# EAGLE design KilomuxV2 (EAGLE 6.6.0)
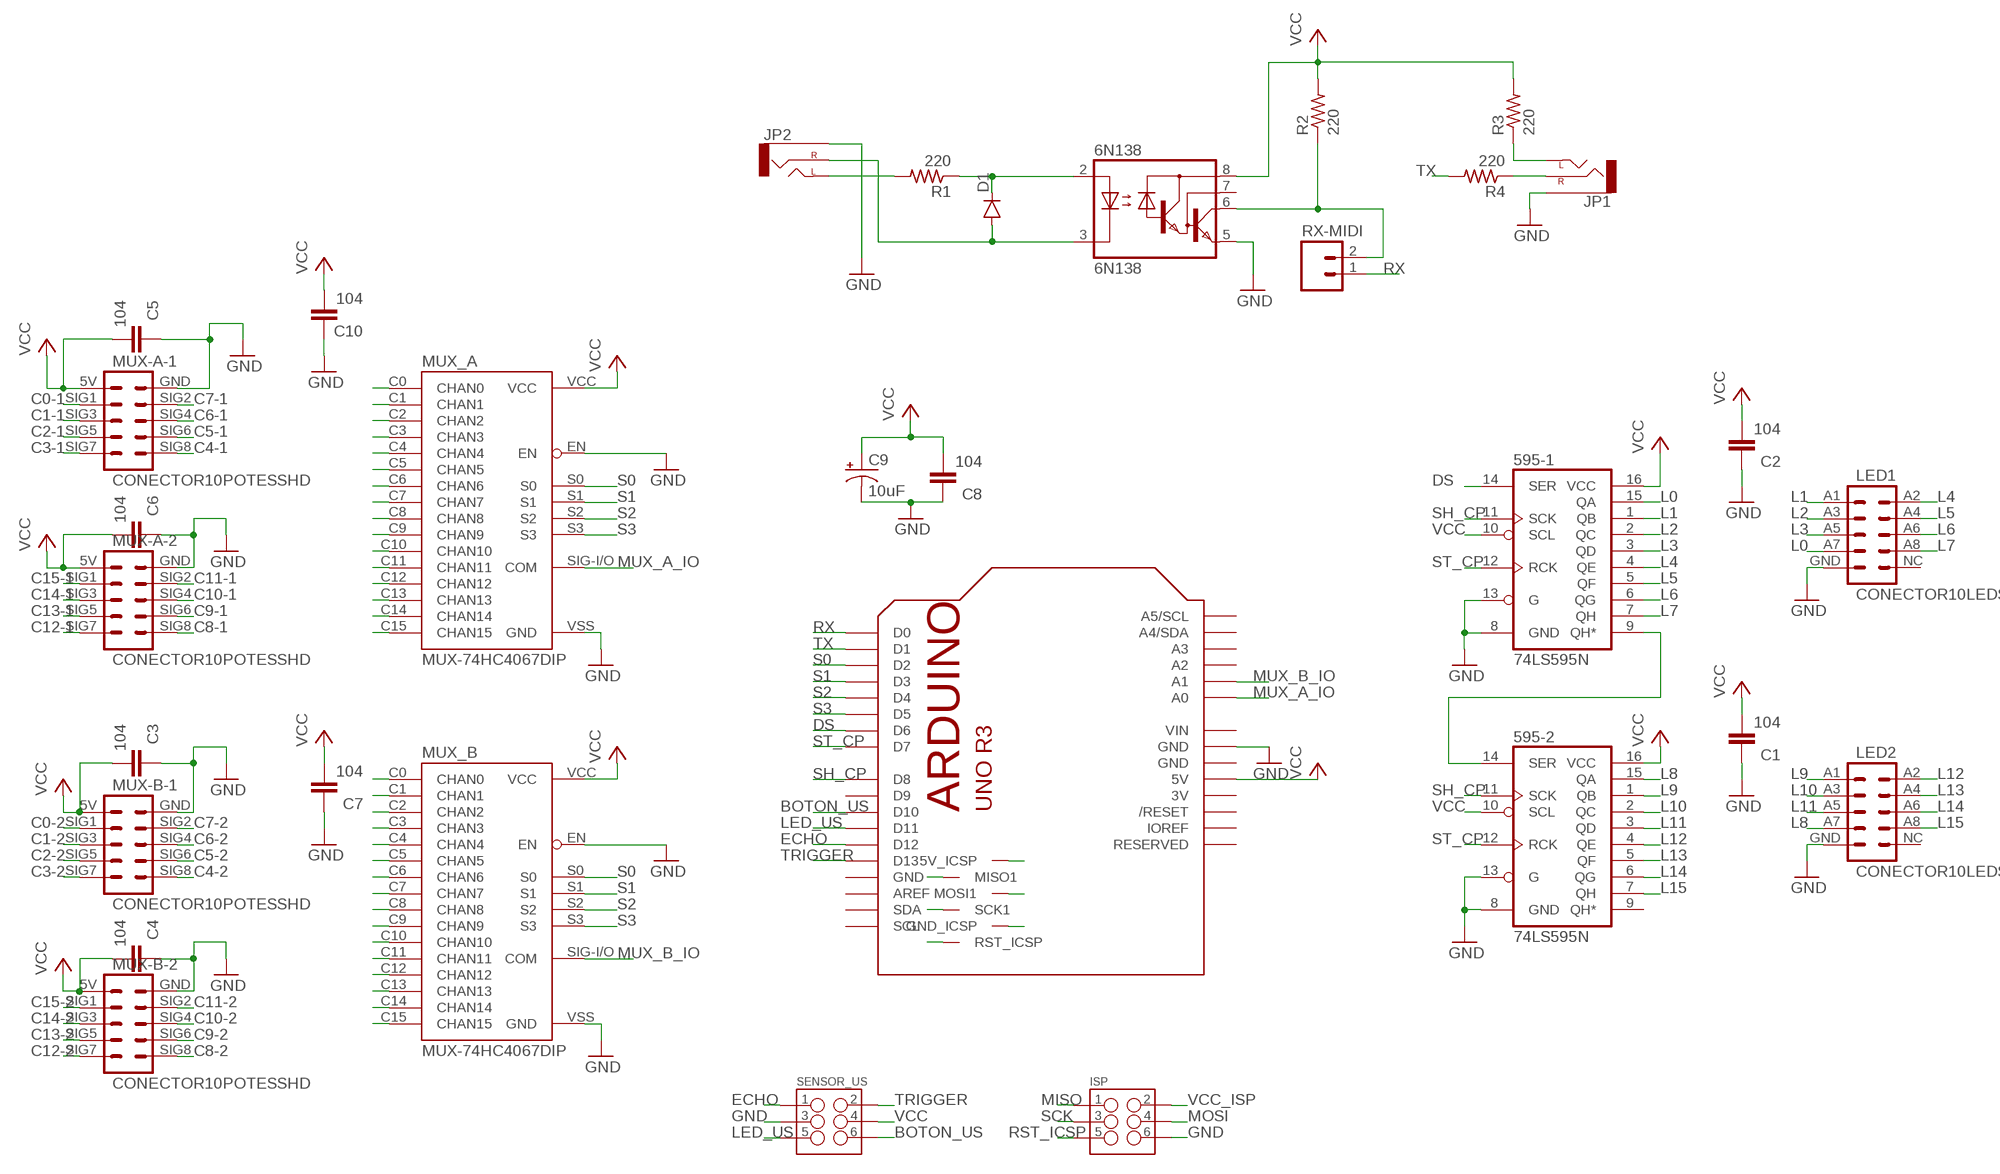
[diagram p0: schematic, sheet 1]

## Parts
6N138  6N138  [DIL08]
595-1  74LS595N  [DIL16]
595-2  74LS595N  [DIL16]
C1  104  C-EU025-025X050  [C025-025X050]
C2  104  C-EU025-025X050  [C025-025X050]
C3  104  C-EU025-025X050  [C025-025X050]
C4  104  C-EU025-025X050  [C025-025X050]
C5  104  C-EU025-025X050  [C025-025X050]
C6  104  C-EU025-025X050  [C025-025X050]
C7  104  C-EU025-025X050  [C025-025X050]
C8  104  C-EU025-025X050  [C025-025X050]
C9  10uF  10UF-25V-20%(PTH)  [CPOL-RADIAL-10UF-25V]
C10  104  C-EU025-025X050  [C025-025X050]
D1  DIODE1N4148  [DIODE-1N4148]
ISP  M03X2NO_SILK  [HEADER-2X3-MALE]
JP1  AUDIO-JACKPTH  [AUDIO-JACK]
JP2  AUDIO-JACKPTH  [AUDIO-JACK]
LED1  CONECTOR10LEDS  [HEADER-2X5-MALE-LEDS]
LED2  CONECTOR10LEDS  [HEADER-2X5-MALE-LEDS]
M1  ARDUINO_R3_ICSP  [ARDUINOR3_ICSP]
MUX-A-1  CONECTOR10POTESSHD  [HEADER-2X3-MALE-POTES]
MUX-A-2  CONECTOR10POTESSHD  [HEADER-2X3-MALE-POTES]
MUX-B-1  CONECTOR10POTESSHD  [HEADER-2X3-MALE-POTES]
MUX-B-2  CONECTOR10POTESSHD  [HEADER-2X3-MALE-POTES]
MUX_A  MUX-74HC4067DIP  [DIL24]
MUX_B  MUX-74HC4067DIP  [DIL24]
R1  220  R-US_0207/10  [0207/10]
R2  220  R-US_0207/10  [0207/10]
R3  220  R-US_0207/10  [0207/10]
R4  220  R-US_0207/10  [0207/10]
RX-MIDI  M02PTH  [1X02]
SENSOR_US  M03X2NO_SILK  [HEADER-2X3-MALE]

## Nets
BOTON_US: M1.D10 SENSOR_US.6
C0-1: MUX-A-1.SIG1 MUX_A.C0(CHAN0)
C0-2: MUX-B-1.SIG1 MUX_B.C0(CHAN0)
C1-1: MUX-A-1.SIG3 MUX_A.C1(CHAN1)
C1-2: MUX-B-1.SIG3 MUX_B.C1(CHAN1)
C2-1: MUX-A-1.SIG5 MUX_A.C2(CHAN2)
C2-2: MUX-B-1.SIG5 MUX_B.C2(CHAN2)
C3-1: MUX-A-1.SIG7 MUX_A.C3(CHAN3)
C3-2: MUX-B-1.SIG7 MUX_B.C3(CHAN3)
C4-1: MUX-A-1.SIG8 MUX_A.C4(CHAN4)
C4-2: MUX-B-1.SIG8 MUX_B.C4(CHAN4)
C5-1: MUX-A-1.SIG6 MUX_A.C5(CHAN5)
C5-2: MUX-B-1.SIG6 MUX_B.C5(CHAN5)
C6-1: MUX-A-1.SIG4 MUX_A.C6(CHAN6)
C6-2: MUX-B-1.SIG4 MUX_B.C6(CHAN6)
C7-1: MUX-A-1.SIG2 MUX_A.C7(CHAN7)
C7-2: MUX-B-1.SIG2 MUX_B.C7(CHAN7)
C8-1: MUX-A-2.SIG8 MUX_A.C8(CHAN8)
C8-2: MUX-B-2.SIG8 MUX_B.C8(CHAN8)
C9-1: MUX-A-2.SIG6 MUX_A.C9(CHAN9)
C9-2: MUX-B-2.SIG6 MUX_B.C9(CHAN9)
C10-1: MUX-A-2.SIG4 MUX_A.C10(CHAN10)
C10-2: MUX-B-2.SIG4 MUX_B.C10(CHAN10)
C11-1: MUX-A-2.SIG2 MUX_A.C11(CHAN11)
C11-2: MUX-B-2.SIG2 MUX_B.C11(CHAN11)
C12-1: MUX-A-2.SIG7 MUX_A.C12(CHAN12)
C12-2: MUX-B-2.SIG7 MUX_B.C12(CHAN12)
C13-1: MUX-A-2.SIG5 MUX_A.C13(CHAN13)
C13-2: MUX-B-2.SIG5 MUX_B.C13(CHAN13)
C14-1: MUX-A-2.SIG3 MUX_A.C14(CHAN14)
C14-2: MUX-B-2.SIG3 MUX_B.C14(CHAN14)
C15-1: MUX-A-2.SIG1 MUX_A.C15(CHAN15)
C15-2: MUX-B-2.SIG1 MUX_B.C15(CHAN15)
DS: 595-1.14(SER) M1.D6
ECHO: M1.D12 SENSOR_US.1
GND: 6N138.5(GND) 595-1.8(GND) 595-1.13(G) 595-2.8(GND) 595-2.13(G) C1.1 C2.1 C3.1 C4.1 C5.1 C6.1 C7.1 C8.1 C9.2(-) C10.1 ISP.6 JP1.SLEEVE JP2.SLEEVE LED1.GND LED2.GND M1.GND@1(GND) M1.GND@4(GND_ICSP) MUX-A-1.GND MUX-A-2.GND MUX-B-1.GND MUX-B-2.GND MUX_A.EN MUX_A.VSS(GND) MUX_B.EN MUX_B.VSS(GND) SENSOR_US.3
L0: 595-1.15(QA) LED1.A7(POS7)
L1: 595-1.1(QB) LED1.A1(POS1)
L2: 595-1.2(QC) LED1.A3(POS3)
L3: 595-1.3(QD) LED1.A5(POS5)
L4: 595-1.4(QE) LED1.A2(POS2)
L5: 595-1.5(QF) LED1.A4(POS4)
L6: 595-1.6(QG) LED1.A6(POS6)
L7: 595-1.7(QH) LED1.A8(POS8)
L8: 595-2.15(QA) LED2.A7(POS7)
L9: 595-2.1(QB) LED2.A1(POS1)
L10: 595-2.2(QC) LED2.A3(POS3)
L11: 595-2.3(QD) LED2.A5(POS5)
L12: 595-2.4(QE) LED2.A2(POS2)
L13: 595-2.5(QF) LED2.A4(POS4)
L14: 595-2.6(QG) LED2.A6(POS6)
L15: 595-2.7(QH) LED2.A8(POS8)
LED_US: M1.D11 SENSOR_US.5
MISO: ISP.1 M1.MISO1
MOSI: ISP.4 M1.MOSI1
MUX_A_IO: M1.A0 MUX_A.SIG-I/O(COM)
MUX_B_IO: M1.A1 MUX_B.SIG-I/O(COM)
N$1: JP2.TIP(LEFT) R1.2
N$2: 6N138.3(C) D1.A JP2.RING(RIGHT)
N$3: 6N138.2(A) D1.C R1.1
N$4: 6N138.6(VO) R2.1 RX-MIDI.2
N$5: JP1.TIP(LEFT) R3.1
N$6: JP1.RING(RIGHT) R4.1
RST_ICSP: ISP.5 M1.RESET_ICSP1(RST_ICSP)
RX: M1.D0 RX-MIDI.1
S0: M1.D2 MUX_A.S0 MUX_B.S0
S1: M1.D3 MUX_A.S1 MUX_B.S1
S2: M1.D4 MUX_A.S2 MUX_B.S2
S3: M1.D5 MUX_A.S3 MUX_B.S3
SCK: ISP.3 M1.SCK1
SH_CP: 595-1.11(SCK) 595-2.11(SCK) M1.D8
SOUT: 595-1.9(QH*) 595-2.14(SER)
ST_CP: 595-1.12(RCK) 595-2.12(RCK) M1.D7
TRIGGER: M1.D13 SENSOR_US.2
TX: M1.D1 R4.2
VCC: 6N138.8(VCC) 595-1.10(SCL) 595-1.16(VCC) 595-2.10(SCL) 595-2.16(VCC) C1.2 C2.2 C3.2 C4.2 C5.2 C6.2 C7.2 C8.2 C9.1(+) C10.2 M1.5V MUX-A-1.5V MUX-A-2.5V MUX-B-1.5V MUX-B-2.5V MUX_A.VCC MUX_B.VCC R2.2 R3.2 SENSOR_US.4
VCC_ISP: ISP.2 M1.5V_ICSP1(5V_ICSP)
Unconnected: 6N138.7(VB) 595-2.9(QH*) LED1.NC LED2.NC M1.A2 M1.A3 M1.A4(A4/SDA) M1.A5(A5/SCL) M1.AREF M1.D9 M1.IOREF M1.RESERVED M1.RESET(/RESET) M1.SCL M1.SDA

## Power pins joined to a net without a drawn wire
3V: M1.3V
GND: M1.GND M1.GND@2(GND)
VIN: M1.VIN

## Library data of the parts
6N138 = KiloMux:6N138: MOTOROLA OPTO COUPLER; MF: VISHAY/TELEFUNKEN; MPN: 6N138; OC_FARNELL: 9860150; OC_NEWARK: 35K5294
595-1 595-2 = KiloMux:74*595: 8-bit SHIFT REGISTER, output latch
C1-C8 C10 = KiloMux:C-EU: CAPACITOR, European symbol
C9 = KiloMux:10UF-25V-20%(PTH): CAP-08440; PROD_ID: CAP-08440
D1 = KiloMux:DIODE: Diode These are standard reverse protection diodes and small signal diodes. SMA package can handle up to about 1A. SOD-323 can handle about 200mA. What the SOD-323 package when ordering, there are some mfgs out there that are 5-pin packages.
ISP SENSOR_US = KiloMux:M03X2: 2x3 .1" header. Shrouded, with keying- CONN-10681 SMT- CONN-11415 Pogo pins- HW-11044
JP1 JP2 = KiloMux:AUDIO-JACK: 3.5mm Audio Jack Simple 3.5mm common PCB mount audio jack. Variant PTH is our storefront SKU PRT-08032
LED1 LED2 = KiloMux:CONECTOR10LEDS
M1 = KiloMux:ARDUINO_R3_ICSP
MUX-A-1 MUX-A-2 MUX-B-1 MUX-B-2 = KiloMux:CONECTOR10POTES: Header 5x2 Standard 10-pin dual row 0.1" header. Commonly used with AVR-ISP. Use with Spark Fun Electronics SKU: PRT-00778
MUX_A MUX_B = KiloMux:MUX-74HC4067: 16-channel analog MUX
R1-R4 = KiloMux:R-US_: RESISTOR, American symbol
RX-MIDI = KiloMux:M02: Standard 2-pin 0.1" header. Use with - straight break away headers ( PRT-00116) - right angle break away headers (PRT-00553) - swiss pins (PRT-00743) - machine pins (PRT-00117) - female headers (PRT-00115) Molex polarized connector foot print use with: PRT-08233 with associated crimp pins and housings. 2.54_SCREWTERM for use with PRT-10571. 3.5mm Screw Terminal footprints for PRT-08084 5mm Screw Terminal footprints for use with PRT-08432

## Board
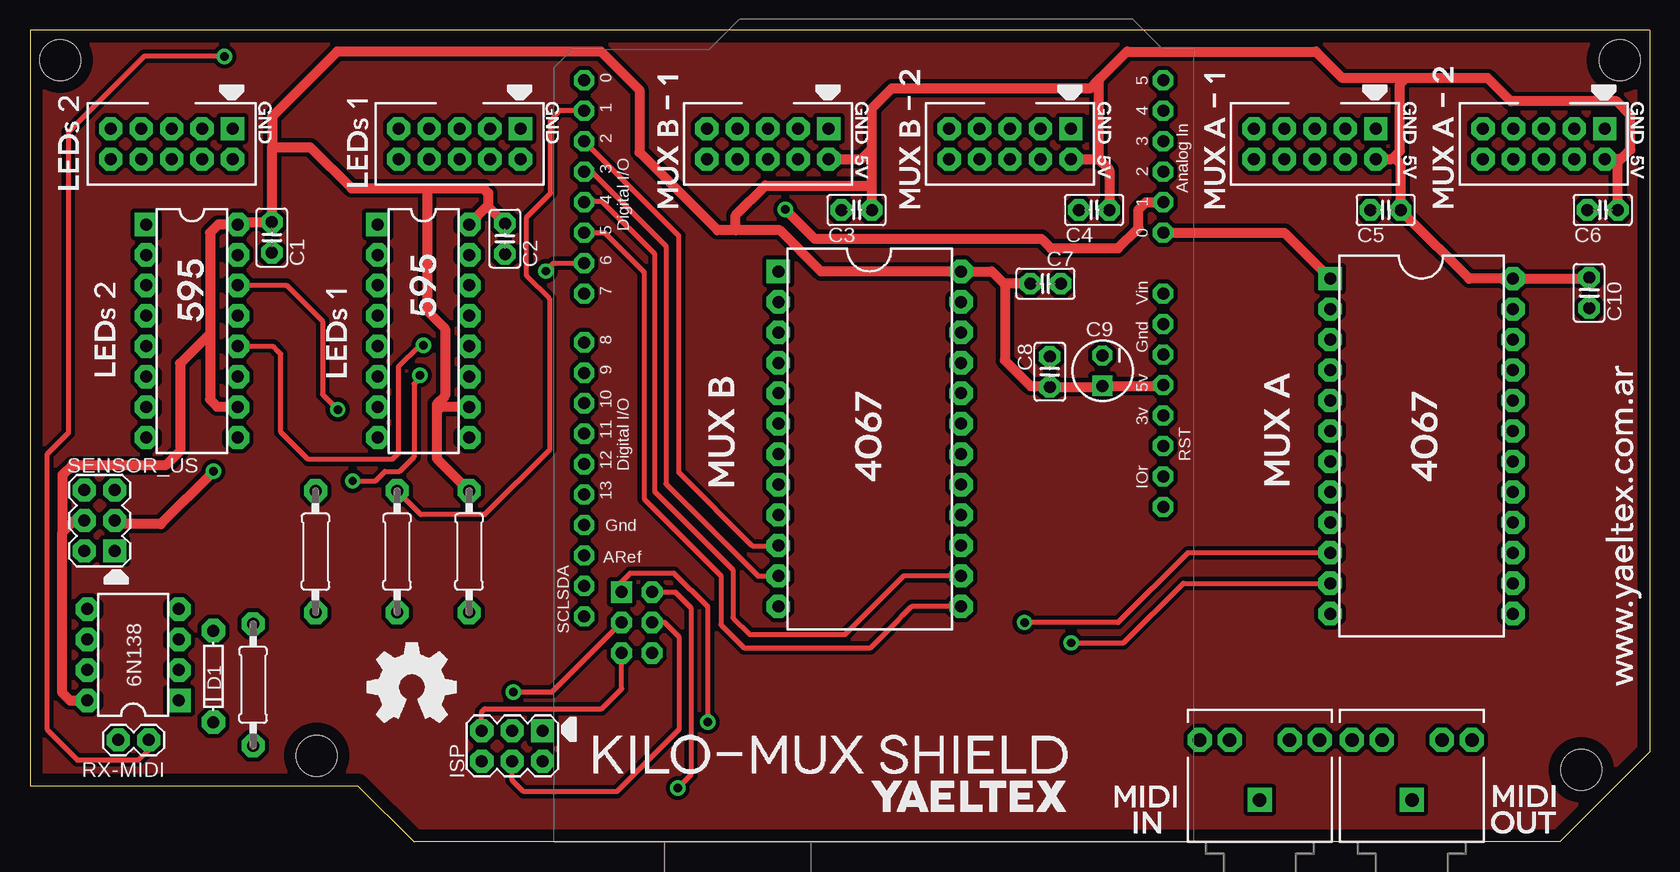
[diagram p1: board, top side]
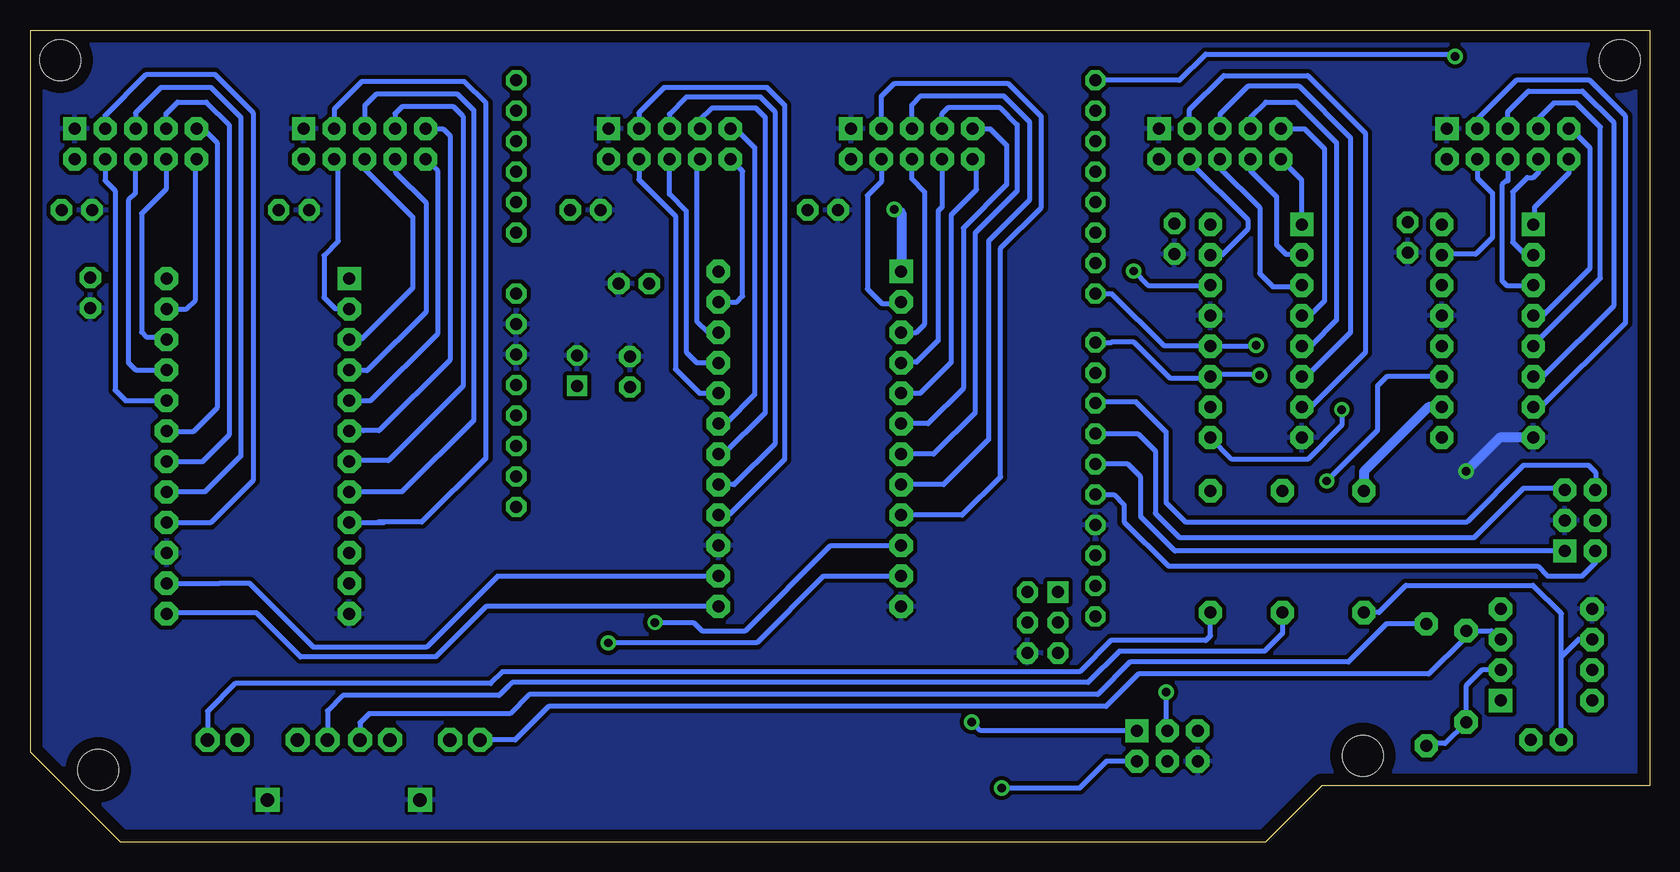
[diagram p2: board, bottom side, seen from below]

Size 135 x 67.7 mm. Coordinates in mm from the lower left corner, seen from the top.
Outline: 135,67.7 0,67.7 0,4.7 27.3,4.7 32,0 127.5,0 135,7.5 135,67.7
Copper layers (1*16): Top 0.035mm / dielectric 1.5mm / Bottom 0.035mm
Design rules "default *": minimum track width 16mil, minimum drill 0.5mm, track to track 14mil, track to pad 16mil, pad to pad 16mil, via to via 16mil, smd to smd 8mil, copper to edge 40mil, drill to drill 8mil, minimum pad ring 10mil, minimum via ring 8mil, stop-mask expansion 4mil, vias tented up to drill 0mil, thermal gap 10mil
Holes 3.4 mm at 2.5,65.2 132.5,65.2 129.3,6 23.9,7.2

### Footprints (pad centres in the part's own frame; a part is rotated, then mirrored left to right if it is on the bottom)
DIL08 = drill 1 pad 1.93 square: 1 -3.81,-3.81 | drill 1 pad 1.93 octagon: 2 -1.27,-3.81; 3 1.27,-3.81; 4 3.81,-3.81; 5 3.81,3.81; 6 1.27,3.81; 7 -1.27,3.81; 8 -3.81,3.81
DIL16 = drill 1 pad 1.93 square: 1 -8.89,-3.81 | drill 1 pad 1.93 octagon: 2 -6.35,-3.81; 3 -3.81,-3.81; 4 -1.27,-3.81; 5 1.27,-3.81; 6 3.81,-3.81; 7 6.35,-3.81; 8 8.89,-3.81; 9 8.89,3.81; 10 6.35,3.81; 11 3.81,3.81; 12 1.27,3.81; 13 -1.27,3.81; 14 -3.81,3.81; 15 -6.35,3.81; 16 -8.89,3.81
C025-025X050 = drill 1 pad 1.778 octagon: 1 -1.27,0; 2 1.27,0
CPOL-RADIAL-10UF-25V = drill 1 pad 1.676 square: 1 1.27,0 | drill 1 pad 1.676 octagon: 2 -1.27,0
DIODE-1N4148 = drill 1 pad 1.93 octagon: A -3.81,0; C 3.81,0
HEADER-2X3-MALE = drill 1 pad 1.93 square: 1 -2.54,-1.27 | drill 1 pad 1.93 octagon: 2 -2.54,1.27; 3 0,-1.27; 4 0,1.27; 5 2.54,-1.27; 6 2.54,1.27
AUDIO-JACK = drill 1.1 pad 2 octagon: RING 5,5; RSH 5,2.5; TIP 5,-5; TSH 5,-2.5 | drill 1.1 pad 2 square: SLEEVE 0,0
HEADER-2X5-MALE-LEDS = drill 1 pad 1.93 octagon: A1 -1.27,5.08; A2 1.27,5.08; A3 -1.27,2.54; A4 1.27,2.54; A5 -1.27,0; A6 1.27,0; A7 -1.27,-2.54; A8 1.27,-2.54; NC -1.27,-5.08 | drill 1 pad 1.93 square: GND 1.27,-5.08
ARDUINOR3_ICSP = drill 1 pad 1.676 octagon: 3V 35.56,2.54; 5V 38.1,2.54; A0 50.8,2.54; A1 53.34,2.54; A2 55.88,2.54; A3 58.42,2.54; A4 60.96,2.54; A5 63.5,2.54; AREF 23.876,50.8; D0 63.5,50.8; D1 60.96,50.8; D2 58.42,50.8; D3 55.88,50.8; D4 53.34,50.8; D5 50.8,50.8; D6 48.26,50.8; D7 45.72,50.8; D8 41.656,50.8; D9 39.116,50.8; D10 36.576,50.8; D11 34.036,50.8; D12 31.496,50.8; D13 28.956,50.8; GND 26.416,50.8; GND@1 43.18,2.54; GND@2 40.64,2.54; IOREF 30.48,2.54; RESERVED 27.94,2.54; RESET 33.02,2.54; SCL 18.796,50.8; SDA 21.336,50.8; VIN 45.72,2.54 | drill 1 pad 1.778 octagon: 5V_ICSP1 20.826,45.149; GND@4 15.746,45.149; MOSI1 18.286,45.149; RESET_ICSP1 15.746,47.689; SCK1 18.286,47.689 | drill 1 pad 1.778 square: MISO1 20.826,47.689
HEADER-2X3-MALE-POTES = drill 1 pad 1.93 octagon: 5V 1.27,5.08; SIG1 -1.27,2.54; SIG2 1.27,2.54; SIG3 -1.27,0; SIG4 1.27,0; SIG5 -1.27,-2.54; SIG6 1.27,-2.54; SIG7 -1.27,-5.08; SIG8 1.27,-5.08 | drill 1 pad 1.93 square: GND -1.27,5.08
DIL24 = drill 1 pad 1.93 octagon: C0 -7.62,-6.35; C1 -7.62,-3.81; C2 -7.62,-1.27; C3 -7.62,1.27; C4 -7.62,3.81; C5 -7.62,6.35; C6 -7.62,8.89; C7 -7.62,11.43; C8 7.62,11.43; C9 7.62,8.89; C10 7.62,6.35; C11 7.62,3.81; C12 7.62,1.27; C13 7.62,-1.27; C14 7.62,-3.81; C15 7.62,-6.35; EN 7.62,-8.89; S0 -7.62,-8.89; S1 -7.62,-11.43; S2 7.62,-11.43; S3 7.62,-13.97; VCC 7.62,13.97; VSS -7.62,-13.97 | drill 1 pad 1.93 square: SIG-I/O -7.62,13.97
0207/10 = drill 1 pad 1.93 octagon: 1 -5.08,0; 2 5.08,0
1X02 = drill 1 pad 1.93 octagon: 1 0,0; 2 2.54,0

### Placement (x,y rotation side)
6N138  8.6,15.6 90 top
595-1  32.8,42.6 270 top
595-2  13.5,42.6 270 top
C1  20.16,50.4 90 top
C2  39.59,50.3 90 top
C3  68.9,52.7 0 top
C4  88.7,52.7 0 top
C5  113,52.7 0 top
C6  131.1,52.7 0 top
C7  84.65,46.55 180 top
C8  85,39.2 270 top
C9  89.4,39.3 270 top
C10  129.97,45.79 90 top
D1  15.29,13.8 270 top
ISP  40.2,8 180 top
JP1  115.2,3.5 90 top
JP2  102.5,3.5 90 top
LED1  35.8,58.2 90 top
LED2  11.8,58.2 90 top
M1  97,0 90 top
MUX-A-1  107.1,58.2 270 top
MUX-A-2  126.2,58.2 270 top
MUX-B-1  61.5,58.2 270 top
MUX-B-2  81.7,58.2 270 top
MUX_A  116,33 0 top
MUX_B  70,33.6 0 top
R1  18.6,13.1 90 top
R2  23.8,24.2 90 top
R3  36.6,24.2 90 top
R4  30.6,24.2 90 top
RX-MIDI  9.9,8.5 180 top
SENSOR_US  5.8,26.8 90 top

### Tracks (layer width: path | path; a pad name or v marks a point on that pad's centre or on a via)
BOTON_US
  Bottom 0.406: SENSOR_US.6 4.5,29.37 4.5,30.82 5.08,31.4 10.5,31.4 15.2,26.7 38.7,26.7 40.3,28.3 40.3,34.2 42.8,36.7 46.08,36.7 M1.D10
C0-1
  Bottom 0.406: MUX_A.C0 106,26.65 | 106,26.65 105.45,26.65 | 106,26.65 105.99,26.66 102.35,26.66 97,32.01 97,61.6 98.8,63.4 107.34,63.4 109.64,61.1 MUX-A-1.SIG1
C0-2
  Bottom 0.406: MUX_B.C0 57.3,27.25 54.1,30.45 54.1,49.5 50.7,52.9 50.7,60.48 53.43,63.21 62.98,63.21 64.05,62.14 MUX-B-1.SIG1
C1-1
  Bottom 0.406: MUX_A.C1 104.02,29.18 98,35.2 98,60.99 99.35,62.34 106.16,62.34 107.1,61.4 MUX-A-1.SIG3
C1-2
  Bottom 0.406: MUX_B.C1 58.84,29.8 55.1,33.54 55.1,50.1 51.7,53.5 51.7,60.07 53.84,62.21 60.73,62.21 61.5,61.44 MUX-B-1.SIG3
C2-1
  Bottom 0.406: MUX_A.C2 108.32,31.79 105.11,31.79 98.9,38 98.9,60.5 99.7,61.3 104,61.3 104.57,60.73 MUX-A-1.SIG5
C2-2
  Bottom 0.406: MUX_B.C2 59.67,32.34 56.2,35.81 56.2,50.8 52.7,54.3 52.72,54.32 52.72,59.82 54.12,61.22 58.48,61.22 58.96,60.74 MUX-B-1.SIG5
C3-1
  Bottom 0.406: MUX-A-1.SIG7 100.57,59.47 100,58.9 100,40.2 105.91,34.29 107.19,34.29 107.2,34.3 108.35,34.3 MUX_A.C3
C3-2
  Bottom 0.406: MUX-B-1.SIG7 54.97,59.47 53.6,58.1 53.6,54.8 57.2,51.2 57.2,37.82 60.14,34.88 MUX_B.C3
C4-1
  Bottom 0.406: MUX_A.C4 106.59,36.81 101,42.4 101,55.91 MUX-A-1.SIG8
C4-2
  Bottom 0.406: MUX_B.C4 60.79,37.41 58.2,40 58.2,52.3 56.1,54.4 56.1,56.61 MUX-B-1.SIG8
C5-1
  Bottom 0.406: MUX-A-1.SIG6 104.56,55.86 102,53.3 102,44.2 106.9,39.3 108.33,39.3 MUX_A.C5
C5-2
  Bottom 0.406: MUX-B-1.SIG6 58.96,52.94 59.3,52.6 59.3,41.8 61.1,40 62.33,40 MUX_B.C5
C6-1
  Bottom 0.406: MUX-A-1.SIG4 107.1,56.1 103.1,52.1 103.1,46.2 107.4,41.9 MUX_A.C6
C6-2
  Bottom 0.406: MUX_B.C6 61.11,42.49 60.4,43.2 60.4,54.2 61.5,55.3 MUX-B-1.SIG4
C7-1
  Bottom 0.406: MUX_A.C7 109.53,44.43 110.5,45.4 110.5,48.9 109.3,50.1 109.3,56.59 MUX-A-1.SIG2
C7-2
  Bottom 0.406: MUX-B-1.SIG2 64.04,55.06 65.2,53.9 65.2,46.1 64,44.9 62.51,44.9 MUX_B.C7
C8-1
  Bottom 0.406: MUX_A.C8 121.97,44.43 121.2,45.2 121.2,56.85 MUX-A-2.SIG8
C8-2
  Bottom 0.406: MUX_B.C8 76.07,45.03 75.6,45.5 75.6,55.91 MUX-B-2.SIG8
C9-1
  Bottom 0.406: MUX-A-2.SIG6 123.66,54.44 125.7,52.4 125.7,42.5 125.3,42.1 123.83,42.1 MUX_A.C9
C9-2
  Bottom 0.406: MUX_B.C9 78.5,42.5 79.4,43.4 79.4,56.69 MUX-B-2.SIG6
C10-1
  Bottom 0.406: MUX-A-2.SIG4 126.2,54.1 126.8,53.5 126.8,39.97 126.18,39.35 MUX_A.C10
C10-2
  Bottom 0.406: MUX-B-2.SIG4 81.7,54 80.3,52.6 80.3,40.85 79.42,39.97 77.64,39.97 MUX_B.C10
C11-1
  Bottom 0.406: MUX_A.C11 127.03,36.8 127.9,37.67 127.9,54.3 128.74,55.14 MUX-A-2.SIG2
C11-2
  Bottom 0.406: MUX-B-2.SIG2 84.24,55.24 81.2,52.2 81.2,39.41 79.2,37.41 MUX_B.C11
C12-1
  Bottom 0.406: MUX-A-2.SIG7 120.57,59.47 119.4,58.3 119.4,36.2 121.4,34.2 123.55,34.2 MUX_A.C12
C12-2
  Bottom 0.406: MUX-B-2.SIG7 76.17,59.47 74.6,57.9 74.6,37.3 77,34.9 77.59,34.9 MUX_B.C12
C13-1
  Bottom 0.406: MUX-A-2.SIG5 123.66,60.74 122.7,61.7 120.3,61.7 118.4,59.8 118.4,33.94 120.64,31.7 123.59,31.7 MUX_A.C13
C13-2
  Bottom 0.406: MUX_B.C13 77.17,32.33 73.7,35.8 73.7,60.4 74.5,61.2 78.14,61.2 79.17,60.17 MUX-B-2.SIG5
C14-1
  Bottom 0.406: MUX-A-2.SIG3 126.2,60.8 124.1,62.9 119.9,62.9 117.4,60.4 117.4,32.21 120.42,29.19 MUX_A.C14
C14-2
  Bottom 0.406: MUX_B.C14 76.3,29.8 72.9,33.2 72.9,60.9 74.1,62.1 80.3,62.1 81.7,60.7 MUX-B-2.SIG3
C15-1
  Bottom 0.406: MUX-A-2.SIG1 128.74,60.56 125.3,64 119.6,64 116.4,60.8 116.4,30.15 119.95,26.6 122.7,26.6 123.57,26.6 MUX_A.C15
C15-2
  Bottom 0.406: MUX_B.C15 77.57,27.3 76.7,27.3 72.1,31.9 72.1,61.43 73.56,62.89 82.15,62.89 84.24,60.8 MUX-B-2.SIG1
DS  (via drill 0.7 pad 1.27)
  Top 0.406: v43,47.6 43,47.63 43.63,48.26 M1.D6
  Bottom 0.406: v43,47.6 41.8,46.4 595-1.14
ECHO
  Bottom 0.406: SENSOR_US.1 39.56,24.26 42.4,27.1 42.4,30.42 43.48,31.5 M1.D12
GND  (via drill 0.7 pad 1.27)
  Top 0.813: v15.3,30.9 10.9,26.5 7.37,26.5 SENSOR_US.3
  Bottom 0.813: 595-2.8 12.49,33.71 v15.3,30.9
  pour Bottom (isolate 0.03): 0,4.7 27.3,4.7 32,0 127.5,0 135,7.5 135,67.7 0,67.7
L0
  Bottom 0.406: LED1.A7 38.34,56.74 33.5,51.9 33.5,51.1 35.7,48.9 36.56,48.9 595-1.15
L1
  Bottom 0.406: 595-1.1 28.99,55.2 LED1.A1
L2
  Bottom 0.406: LED1.A3 33.26,55.96 31.1,53.8 31.1,49.8 30.3,49 29.04,49 595-1.2
L3
  Bottom 0.406: LED1.A5 35.8,56.2 32.5,52.9 32.5,47.4 31.4,46.3 29.1,46.3 595-1.3
L4
  Bottom 0.406: LED1.A2 28.77,59.47 27.1,57.8 27.1,45.1 28.3,43.9 28.96,43.9 595-1.4
L5
  Bottom 0.406: LED1.A4 33.26,60.44 32,61.7 29.5,61.7 26.1,58.3 26.1,43.5 28.2,41.4 28.92,41.4 595-1.5
L6
  Bottom 0.406: 595-1.6 28.61,38.79 24.9,42.5 24.9,58.7 29.2,63 33.5,63 35.8,60.7 LED1.A6
L7
  Bottom 0.406: LED1.A8 38.34,61.06 35.5,63.9 28.5,63.9 23.7,59.1 23.7,40.8 28.2,36.3 28.94,36.3 595-1.7
L8
  Bottom 0.406: LED2.A7 14.34,55.34 13.1,54.1 13.1,50.4 14.5,49 17.26,49 595-2.15
L9
  Bottom 0.406: LED2.A1 6.72,55.78 9.6,52.9 9.6,51.58 595-2.1
L10
  Bottom 0.406: LED2.A3 9.2,56.87 9.2,55.9 9.7,55.4 10.2,55.4 11.4,54.2 11.4,50 10.4,49 9.74,49 595-2.2
L11
  Bottom 0.406: LED2.A5 11.8,55.1 12,55.1 12.3,54.8 12.3,46.8 11.9,46.4 595-2.3
L12
  Bottom 0.406: LED2.A2 6.57,59.47 5,57.9 5,47.8 8.9,43.9 9.66,43.9 595-2.4
L13
  Bottom 0.406: 595-2.5 9.69,41.41 4.1,47 4.1,59.6 6.1,61.6 8,61.6 9.2,60.4 9.2,59.53 LED2.A4
L14
  Bottom 0.406: LED2.A6 11.8,60.9 10.1,62.6 5.6,62.6 3,60 3,44.7 8.9,38.8 595-2.6
L15
  Bottom 0.406: 595-2.7 9.05,36.25 2,43.3 2,60.5 5,63.5 11.1,63.5 14.3,60.3 14.3,59.51 LED2.A8
LED_US
  Bottom 0.406: SENSOR_US.5 7.23,29.5 10.5,29.5 14.6,25.4 39.2,25.4 41.2,27.4 41.2,32.6 42.6,34 46.16,34 M1.D11
MISO  (via drill 0.7 pad 1.27)
  Top 0.406: M1.MISO1 49.3,21.7 50,22.4 53.7,22.4 56.5,19.6 v56.5,10
  Bottom 0.406: ISP.1 55.77,9.27 v56.5,10
MOSI
  Top 0.406: M1.MOSI1 51.87,18.3 52.9,18.3 54.1,17.1 54.1,9.4 48.9,4.2 41.15,4.2 40.2,5.15 ISP.4
MUX_A_IO
  Top 0.813: M1.A0 104.55,50.8 MUX_A.SIG-I/O
MUX_B_IO  (via drill 0.7 pad 1.27)
  Top 0.813: M1.A1 93,53.33 92.4,52.73 92.4,51.2 90.7,49.5 85.1,49.5 84.3,50.3 65.4,50.3 v62.96,52.73
  Bottom 0.813: v62.96,52.73 62.69,52.73 62.37,52.41 MUX_B.SIG-I/O
N$1
  Bottom 0.406: R1.2 21.92,18.18 25.1,15 43.3,15 46,12.3 93.39,12.3 94.99,10.7 106.73,10.7 107.5,9.93 JP2.TIP
N$2
  Bottom 0.406: 6N138.3 13.15,17.61 D1.A 15.4,17.5 15.4,16.9 15.5,16.9 18.4,14 42.6,14 45.3,11.3 91.76,11.3 94.56,8.5 JP2.RING
N$3
  Bottom 0.406: 6N138.2 13.97,14.33 15.3,13 D1.C 17.06,8.22 18.4,8.22 R1.1
N$4
  Bottom 0.406: RX-MIDI.2 7.36,15.44 | 7.36,15.44 5.9,16.9 4.82,16.9 6N138.6 | R2.1 22.55,19.13 22.38,19.3 22.38,19.32 20.3,21.4 9.72,21.4 7.4,19.08 7.4,19.07 7.35,19.02 7.36,19.01 7.36,15.44
N$5
  Bottom 0.406: R3.1 36.6,17.2 37,16.8 44.9,16.8 47.5,14.2 95.61,14.2 96.6,13.21 117.89,13.21 120.2,10.9 JP1.TIP
N$6
  Bottom 0.406: R4.1 30.6,17.4 32.1,15.9 44.2,15.9 46.8,13.3 94.81,13.3 94.91,13.2 95.11,13 95.9,12.21 108.92,12.21 110.2,10.93 JP1.RING
N$7
  pour Top (isolate 0.05): 0,67.7 135,67.7 135,7.5 127.5,0 32,0 27.3,4.7 0,4.7
RST_ICSP
  Top 0.406: ISP.5 37.66,10.86 37.9,11.1 47.65,11.1 49.33,12.78 49.33,15.73 M1.RESET_ICSP1
RX  (via drill 0.7 pad 1.27)
  Top 0.406: v16.2,65.5 9.5,65.5 3.2,59.2 3.2,34.1 1.4,32.3 1.4,9.4 3.93,6.84 9.04,6.84 9.9,7.7 RX-MIDI.1
  Bottom 0.406: v16.2,65.5 16.4,65.7 37,65.7 39.2,63.5 M1.D0
S0  (via drill 0.7 pad 1.27)
  Top 0.406: M1.D2 54.1,50.52 54.1,30.8 60.2,24.7 MUX_B.S0 | MUX_A.S0 96.51,24.11 90.7,18.3 v82.9,18.3
  Bottom 0.406: v82.9,18.3 79.7,18.3 79,17.6 75.37,17.6 68.26,24.71 MUX_B.S0
S1  (via drill 0.7 pad 1.27)
  Top 0.406: M1.D3 46.82,55.88 53,49.7 53,29.85 60.68,22.17 MUX_B.S1 | v86.8,16.6 91.16,16.6 96.13,21.57 MUX_A.S1
  Bottom 0.406: v86.8,16.6 74.4,16.6 68.84,22.16 MUX_B.S1
S2
  Top 0.406: M1.D4 46.26,53.4 47.7,53.4 52.1,49 52.1,29.2 58.6,22.7 58.6,18.7 60,17.3 67.94,17.3 72.81,22.17 MUX_B.S2
  Bottom 0.406: MUX_A.S2 119.17,21.57 119.17,21.56 116.7,21.56 111.37,16.23 101.95,16.23 96.04,22.15 77.64,22.15 MUX_B.S2
S3
  Top 0.406: M1.D5 47.9,50.8 51.2,47.5 51.2,28.6 57.6,22.2 57.6,18.1 59.5,16.2 70.07,16.2 72.44,18.57 72.78,18.92 73.5,19.63 MUX_B.S3
  Bottom 0.406: MUX_A.S3 123.55,19.1 116.12,19.1 112.45,15.43 | 112.45,15.43 112.44,15.42 | MUX_B.S3 96.98,19.63 101.18,15.43 112.45,15.43
SCK  (via drill 0.7 pad 1.27)
  Top 0.406: v40.3,12.5 43.52,12.5 M1.SCK1
  Bottom 0.406: v40.3,12.5 40.3,9.37 ISP.3
SH_CP  (via drill 0.7 pad 1.27)
  Top 0.406: v26.9,30.1 28.8,30.1 29.6,30.9 30.8,30.9 32,32.1 32,38.2 32.5,38.7 v32.5,38.9
  Bottom 0.406: M1.D8 44.86,41.66 44.85,41.66 42.96,41.66 40,38.7 36.7,38.7 595-1.11 36.4,39 32.6,39 v32.5,38.9 | 595-2.11 21.92,38.79 22.68,38.03 22.68,34.32 v26.9,30.1
SOUT  (via drill 0.7 pad 1.27)
  Top 0.406: 595-2.14 21.38,46.41 24.38,43.41 24.38,37.32 v25.65,36.05
  Bottom 0.406: 595-1.9 34.8,31.9 28.5,31.9 25.65,34.75 v25.65,36.05
ST_CP  (via drill 0.7 pad 1.27)
  Top 0.406: v32.8,41.4 32.5,41.4 30.7,39.6 30.7,32.4 30.2,31.9 23.2,31.9 20.9,34.2 20.9,40.7 20.7,40.9 20.3,41.3 20.27,41.33 595-2.12
  Bottom 0.406: v32.8,41.4 32.87,41.33 595-1.12 36.68,41.4 40.5,41.4 44.8,45.7 46.18,45.7 M1.D7
TRIGGER
  Bottom 0.406: SENSOR_US.2 4.5,24.23 4.5,23.3 5.62,22.18 8.5,22.18 9.33,23 40.1,23 43.8,26.7 43.8,28.1 44.66,28.96 M1.D13
TX
  Top 0.406: M1.D1 44.16,60.96 43.4,60.2 43.4,54.1 41.4,52.1 41.4,47.2 43.3,45.3 43.3,32.7 37.9,27.3 32.58,27.3 R4.2
VCC
  Top 0.813: 114.7,63.7 121.5,63.7 123.45,61.75 132.25,61.75 133.4,60.61 133.4,57.72 132.6,56.92 | 114.7,63.7 109.4,63.7 107.2,65.9 91.44,65.9 89.19,63.65 89.08,63.54 | 58.82,51 62.5,51 65.93,47.57 MUX_B.VCC 80.18,47.57 81.2,46.55 | 58.82,51 57.3,51 50.8,57.5 50.8,62.7 47.6,65.9 25.6,65.9 20.18,60.48 20.18,57.93 | 15,42.4 15,36.9 15.6,36.3 17.26,36.3 595-2.10 | 15,42.4 12.5,39.9 12.5,32.6 11.3,31.4 3.5,31.4 2.7,30.6 2.7,25.8 | 20.18,57.93 23.38,57.93 26.8,54.5 33.1,54.5 | 33.1,54.5 37.8,54.5 38.2,54.1 38.2,52.96 | 33.1,54.5 33.1,44.3 34.6,42.8 34.6,37.2 33.9,36.5 33.9,35.9 | 20.18,57.93 20.18,51.67 C1.2 17.49,51.67 595-2.16 15.69,51.49 15,50.8 15,42.4 | 38.2,52.96 C2.2 | 38.2,52.96 38.08,52.96 595-1.16 | 2.7,25.8 2.7,12.41 3.32,11.79 6N138.8 | 2.7,25.8 3.7,26.8 SENSOR_US.4 | 595-1.10 34.25,36.25 33.9,35.9 | 33.9,35.9 33.9,31.98 R3.2 | C3.2 70.17,54.84 | 70.17,54.84 70.17,57.8 | 81.2,46.55 81.25,46.5 81.25,40.15 83.4,38 84.93,38 C8.2 89.3,37.93 C9.1 94.39,38.03 M1.5V | MUX-B-1.5V 69.3,56.93 70.17,57.8 | MUX-A-1.5V 113.53,56.93 113.7,57.1 | 113.7,57.1 114.2,57.6 114.2,63.2 114.7,63.7 | 113.7,57.1 114.27,56.53 C5.2 114.74,52.2 119.97,46.97 MUX_A.VCC 129.88,46.97 C10.2 | 132.6,56.92 MUX-A-2.5V | C6.2 132.37,56.69 132.6,56.92 | C7.2 81.2,46.55 | MUX-B-2.5V 89.08,56.93 | 89.08,56.93 89.97,56.04 C4.2 | 58.82,51 58.82,52.25 61.31,54.74 70.07,54.74 70.17,54.84 | 89.08,63.54 89.08,56.93 | 70.17,57.8 70.17,61.16 71.85,62.84 88.38,62.84 89.08,63.54
  Bottom 0.813: 20.2,51.71 C1.2 | 595-2.10 18.43,36.25 23.81,30.87 R2.2
VCC_ISP  (via drill 0.7 pad 1.27)
  Top 0.406: M1.5V_ICSP1 53.77,20.83 55.1,19.5 55.1,5.6 v54,4.5
  Bottom 0.406: ISP.2 45.21,6.73 45.24,6.76 47.5,4.5 v54,4.5